# EAGLE design SRG_1_0 (EAGLE 8.3.2)
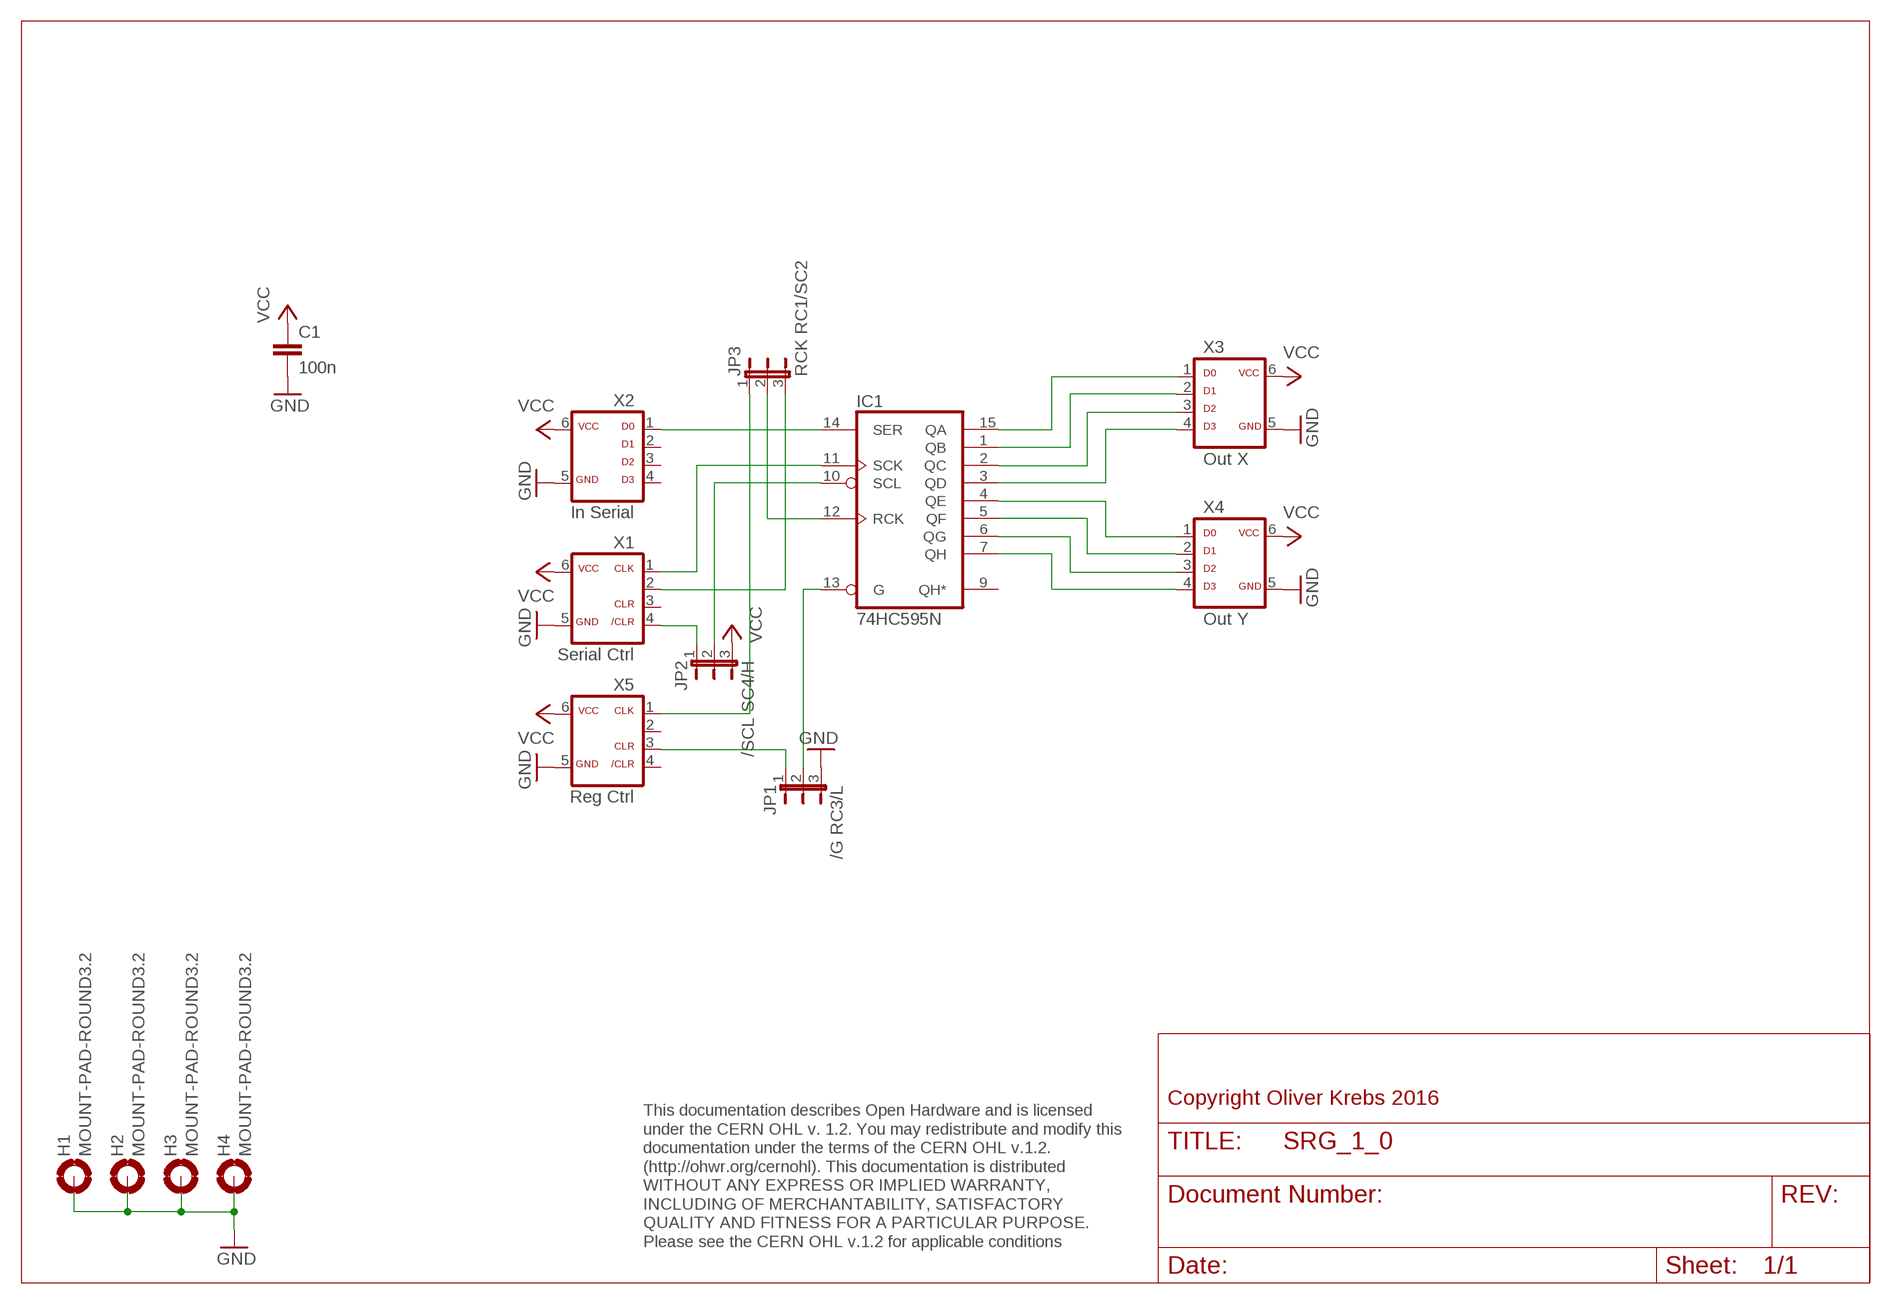
[diagram p0: schematic, sheet 1]

## Parts
C1  100n  C-EU050-025X075  [C050-025X075]
H1  MOUNT-PAD-ROUND3.2  [3,2-PAD]
H2  MOUNT-PAD-ROUND3.2  [3,2-PAD]
H3  MOUNT-PAD-ROUND3.2  [3,2-PAD]
H4  MOUNT-PAD-ROUND3.2  [3,2-PAD]
IC1  74HC595N  [DIL16]
JP1  /G RC3/L  JP2EJP2-U  [JP2-U]
JP2  /SCL SC4/H  JP2EJP2-U  [JP2-U]
JP3  RCK RC1/SC2  JP2EJP2-U  [JP2-U]
X1  Serial Ctrl  ML6C  [ML-6]
X2  In Serial  ML6D  [ML-6]
X3  Out X  ML6D  [ML-6]
X4  Out Y  ML6D  [ML-6]
X5  Reg Ctrl  ML6C  [ML-6]

## Nets
GND: C1.2 H1.B3,2(MOUNT) H2.B3,2(MOUNT) H3.B3,2(MOUNT) H4.B3,2(MOUNT) JP1.3 X1.5 X2.5 X3.5 X4.5 X5.5
N$1: IC1.15(QA) X3.1
N$2: IC1.1(QB) X3.2
N$3: IC1.2(QC) X3.3
N$4: IC1.3(QD) X3.4
N$5: IC1.4(QE) X4.1
N$6: IC1.5(QF) X4.2
N$7: IC1.6(QG) X4.3
N$8: IC1.7(QH) X4.4
N$9: IC1.14(SER) X2.1
N$10: IC1.10(SCL) JP2.2
N$11: IC1.11(SCK) X1.1
N$12: IC1.12(RCK) JP3.2
N$13: IC1.13(G) JP1.2
N$14: JP1.1 X5.3
N$15: JP2.1 X1.4
N$16: JP3.1 X5.1
N$17: JP3.3 X1.2
VCC: C1.1 JP2.3 X1.6 X2.6 X3.6 X4.6 X5.6
Unconnected: IC1.9(QH*) X1.3 X2.2 X2.3 X2.4 X5.2 X5.4

## Notes on the sheet
- Copyright Oliver Krebs 2016
- This documentation describes Open Hardware and is licensed 
  under the CERN OHL v. 1.2. You may redistribute and modify this 
  documentation under the terms of the CERN OHL v.1.2. 
  (http://ohwr.org/cernohl). This documentation is distributed
  WITHOUT ANY EXPRESS OR IMPLIED WARRANTY, 
  INCLUDING OF MERCHANTABILITY, SATISFACTORY 
  QUALITY AND FITNESS FOR A PARTICULAR PURPOSE. 
  Please see the CERN OHL v.1.2 for applicable conditions

## Power pins joined to a net without a drawn wire
GND: IC1.8(GND)
VCC: IC1.16(VCC)

## Library data of the parts
C1 = 01-my_rcl:C-EU: CAPACITOR, European symbol
H1-H4 = holes:MOUNT-PAD-ROUND: MOUNTING PAD, round
IC1 = 74xx-eu:74*595: 8-bit SHIFT REGISTER, output latch
JP1-JP3 = 01-my-jumper:JP2E: JUMPER
X1 X5 = 01-my-con:ML6C
X2-X4 = 01-my-con:ML6D

## Board
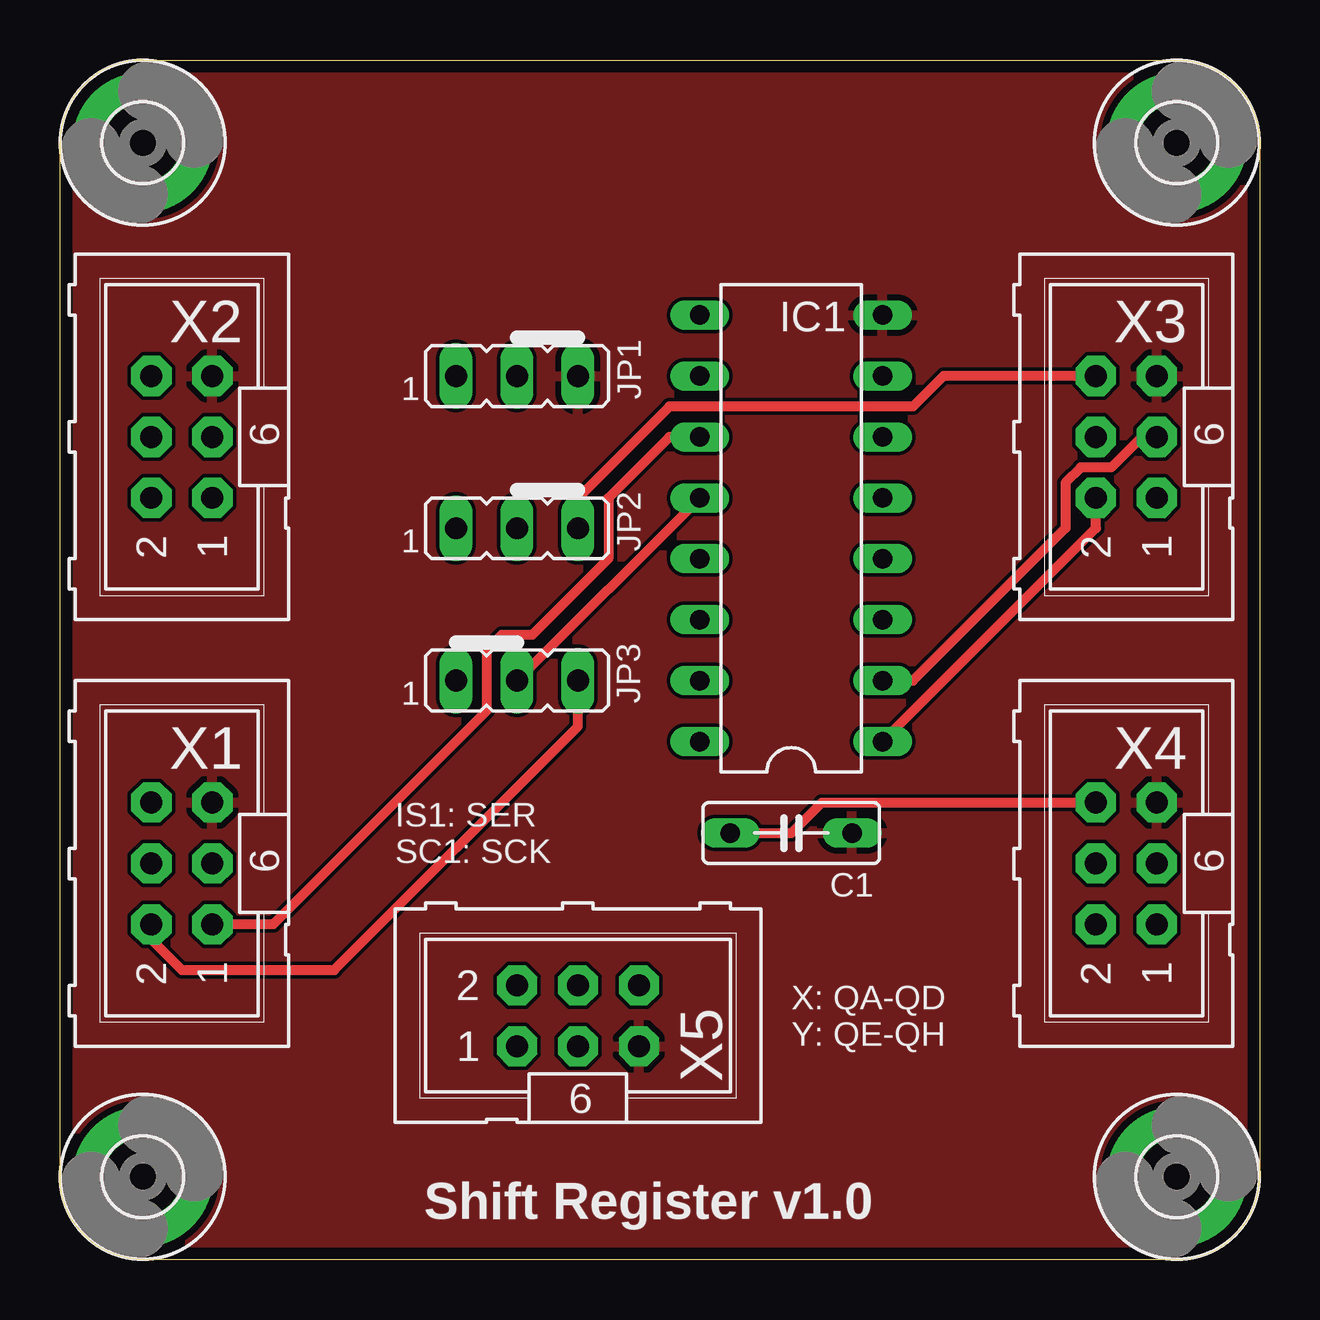
[diagram p1: board, top side]
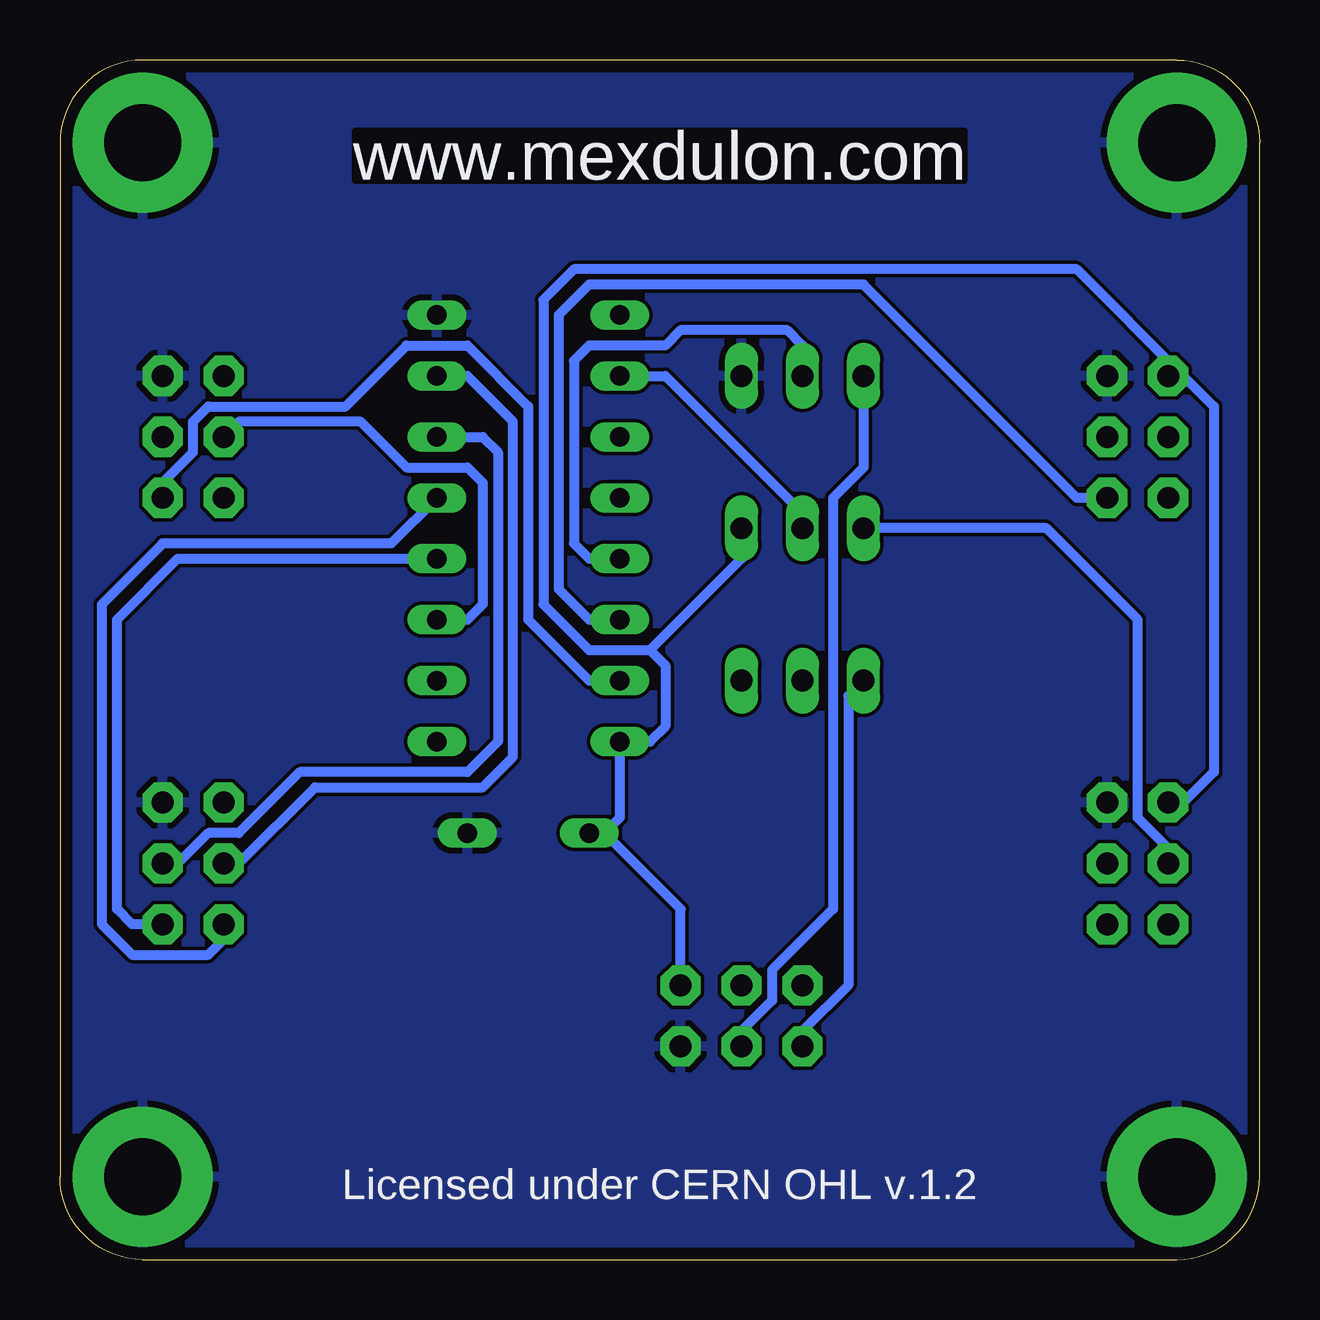
[diagram p2: board, bottom side, seen from below]

Size 50 x 50 mm. Coordinates in mm from the lower left corner, seen from the top.
Outline: 0,3.45 0,46.55 arc-90 3.45,50 46.55,50 arc-90 50,46.55 50,3.45 arc-90 46.55,0 3.45,0 arc-90 0,3.45
Copper layers (1*16): Top 0.035mm / dielectric 1.6mm / Bottom 0.035mm
Design rules "Elecrow_2-layer_PCB_eagle_rule": minimum track width 6mil, minimum drill 12mil, track to track 6mil, track to pad 6mil, pad to pad 6mil, via to via 8mil, smd to smd 0mil, copper to edge 20mil, drill to drill 10mil, minimum pad ring 6mil, minimum via ring 6mil, stop-mask expansion 0mil, vias tented up to drill 100mil, thermal gap 10mil

### Footprints (pad centres in the part's own frame; a part is rotated, then mirrored left to right if it is on the bottom)
C050-025X075 = drill 0.813 long: 1 -2.54,0; 2 2.54,0
3,2-PAD = drill 3.2 pad 5.842: B3,2 0,0
DIL16 = drill 0.813 long: 1 -8.89,-3.81; 2 -6.35,-3.81; 3 -3.81,-3.81; 4 -1.27,-3.81; 5 1.27,-3.81; 6 3.81,-3.81; 7 6.35,-3.81; 8 8.89,-3.81; 9 8.89,3.81; 10 6.35,3.81; 11 3.81,3.81; 12 1.27,3.81; 13 -1.27,3.81; 14 -3.81,3.81; 15 -6.35,3.81; 16 -8.89,3.81
JP2-U = drill 0.914 long: 1 -2.54,0; 2 0,0; 3 2.54,0
ML-6 = drill 0.914 pad 1.676 octagon: 1 -2.54,-1.27; 2 -2.54,1.27; 3 0,-1.27; 4 0,1.27; 5 2.54,-1.27; 6 2.54,1.27

### Placement (x,y rotation side)
C1  30.48,17.78 0 top
H1  3.45,3.45 0 top
H2  3.45,46.55 0 top
H3  46.55,46.55 0 top
H4  46.55,3.45 0 top
IC1  30.48,30.48 90 top
JP1  19.05,36.83 0 top
JP2  19.05,30.48 0 top
JP3  19.05,24.13 0 top
X1  5.08,16.51 90 top
X2  5.08,34.29 90 top
X3  44.45,34.29 90 top
X4  44.45,16.51 90 top
X5  21.59,10.16 0 top

### Tracks (layer width: path | path; a pad name or v marks a point on that pad's centre or on a via)
GND
  pour Bottom: 0,0 50.8,0 50.8,50.8 0,50.8
  pour Top: 0,50.16 50.16,50.16 50.16,0 0,0
N$1
  Bottom 0.406: X3.1 45.72,32.38 44.45,33.66 44.45,34.92 43.81,35.56 38.1,35.56 35.56,38.1 33.02,38.1 30.48,35.56 30.48,26.67 27.94,24.13 IC1.15
N$2
  Top 0.406: IC1.1 43.18,30.48 X3.2
N$3
  Top 0.406: X3.3 45.09,34.29 43.81,33.02 42.55,33.02 41.91,32.38 41.91,30.48 35.56,24.13 IC1.2
N$4
  Bottom 0.406: IC1.3 33.02,26.67 32.38,27.3 32.38,32.38 33.02,33.02 35.56,33.02 37.47,34.92 42.55,34.92 X3.4
N$5
  Bottom 0.406: X4.1 46.99,13.97 47.62,14.61 47.62,26.67 45.09,29.21 IC1.4
N$6
  Bottom 0.406: IC1.5 36.2,29.84 45.72,29.84 48.26,27.3 48.26,13.97 46.99,12.7 43.81,12.7 43.18,13.34 X4.2
N$7
  Bottom 0.406: IC1.6 32.38,34.29 31.75,33.66 31.75,21.59 33.02,20.32 40.01,20.32 42.55,17.78 43.81,17.78 45.09,16.51 X4.3
N$8
  Bottom 0.406: X4.4 42.55,16.51 39.37,19.68 32.38,19.68 31.11,20.95 31.11,34.92 33.02,36.83 IC1.7
N$9
  Bottom 0.406: X2.1 7.62,31.75 16.51,40.64 27.94,40.64 29.21,39.37 29.21,27.94 27.94,26.67 IC1.14
N$10
  Bottom 0.406: IC1.10 24.77,36.83 19.05,31.11 JP2.2
N$11
  Top 0.406: IC1.11 25.4,34.29 22.86,31.75 22.86,29.21 19.68,26.04 18.41,26.04 17.78,25.4 17.78,22.86 8.89,13.97 X1.1
N$12
  Top 0.406: JP3.2 IC1.12
N$13
  Bottom 0.406: JP1.2 19.05,38.1 19.68,38.73 24.13,38.73 24.77,38.1 27.94,38.1 28.57,37.47 28.57,29.84 27.94,29.21 IC1.13
N$14
  Bottom 0.406: JP1.1 16.51,33.02 17.78,31.75 17.78,14.61 20.32,12.06 20.32,10.79 21.59,9.53 X5.3
N$15
  Bottom 0.406: X1.4 3.81,17.14 5.08,18.41 5.08,26.67 8.89,30.48 JP2.1
N$16
  Bottom 0.406: X5.1 19.05,9.53 17.14,11.43 17.14,23.5 JP3.1
N$17
  Top 0.406: X1.2 3.81,13.34 5.08,12.06 11.43,12.06 21.59,22.23 JP3.3
VCC
  Top 0.406: X3.6 36.83,36.83 35.56,35.56 25.4,35.56 21.59,31.75 JP2.3 | C1.1 30.48,17.78 31.75,19.05 X4.6
  Bottom 0.406: X5.6 24.13,14.61 27.3,17.78 | 27.3,17.78 C1.1 | 27.3,17.78 26.67,18.41 IC1.16 25.4,21.59 24.77,22.23 24.77,24.77 25.4,25.4 | 3.17,36.83 1.91,35.56 1.91,20.32 3.17,19.05 X1.6 | X2.6 3.17,36.83 | 3.17,36.83 7.62,41.27 28.57,41.27 29.84,40.01 29.84,27.3 27.94,25.4 25.4,25.4 | JP2.3 21.59,29.21 25.4,25.4

### Text on the board
Bottom: www.mexdulon.com
tNames: IS1: SER / SC1: SCK | X: QA-QD / Y: QE-QH | Shift Register v1.0
bNames: www.mexdulon.com | Licensed under CERN OHL v.1.2
200bmp: E:/Bilder/Elektronik/Modulion/Mexdulon/mexdulon_50x50_pcb.bmp